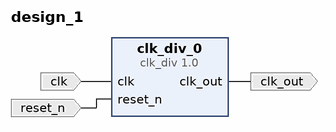
[diagram p0: block diagram of the top level]
# Vivado block design design_1, xc7z010clg400-1, Vivado 2021.1
create_bd_design design_1

create_bd_port -dir I -type rst reset_n
create_bd_port -dir I -type clk clk
set_property -dict {CONFIG.FREQ_HZ 10000000} [get_bd_ports clk]
create_bd_port -dir O -type clk clk_out

create_bd_cell -type ip -vlnv kashapovd.xyz:user:clk_div:1.0 clk_div_0

# ---- connections ----

connect_bd_net [get_bd_ports clk] [get_bd_pins clk_div_0/clk]
connect_bd_net [get_bd_pins clk_div_0/clk_out] [get_bd_ports clk_out]
connect_bd_net [get_bd_ports reset_n] [get_bd_pins clk_div_0/reset_n]

validate_bd_design
save_bd_design
